# Altium schematic sheet FPGA_PortSwitcher(Nanoboard).SchDoc
size B; Organization: Altium Limited; Address1: L3, 12a Rodborough Rd; Address2: Frenchs Forest; Address3: NSW; Address4: Australia 2086
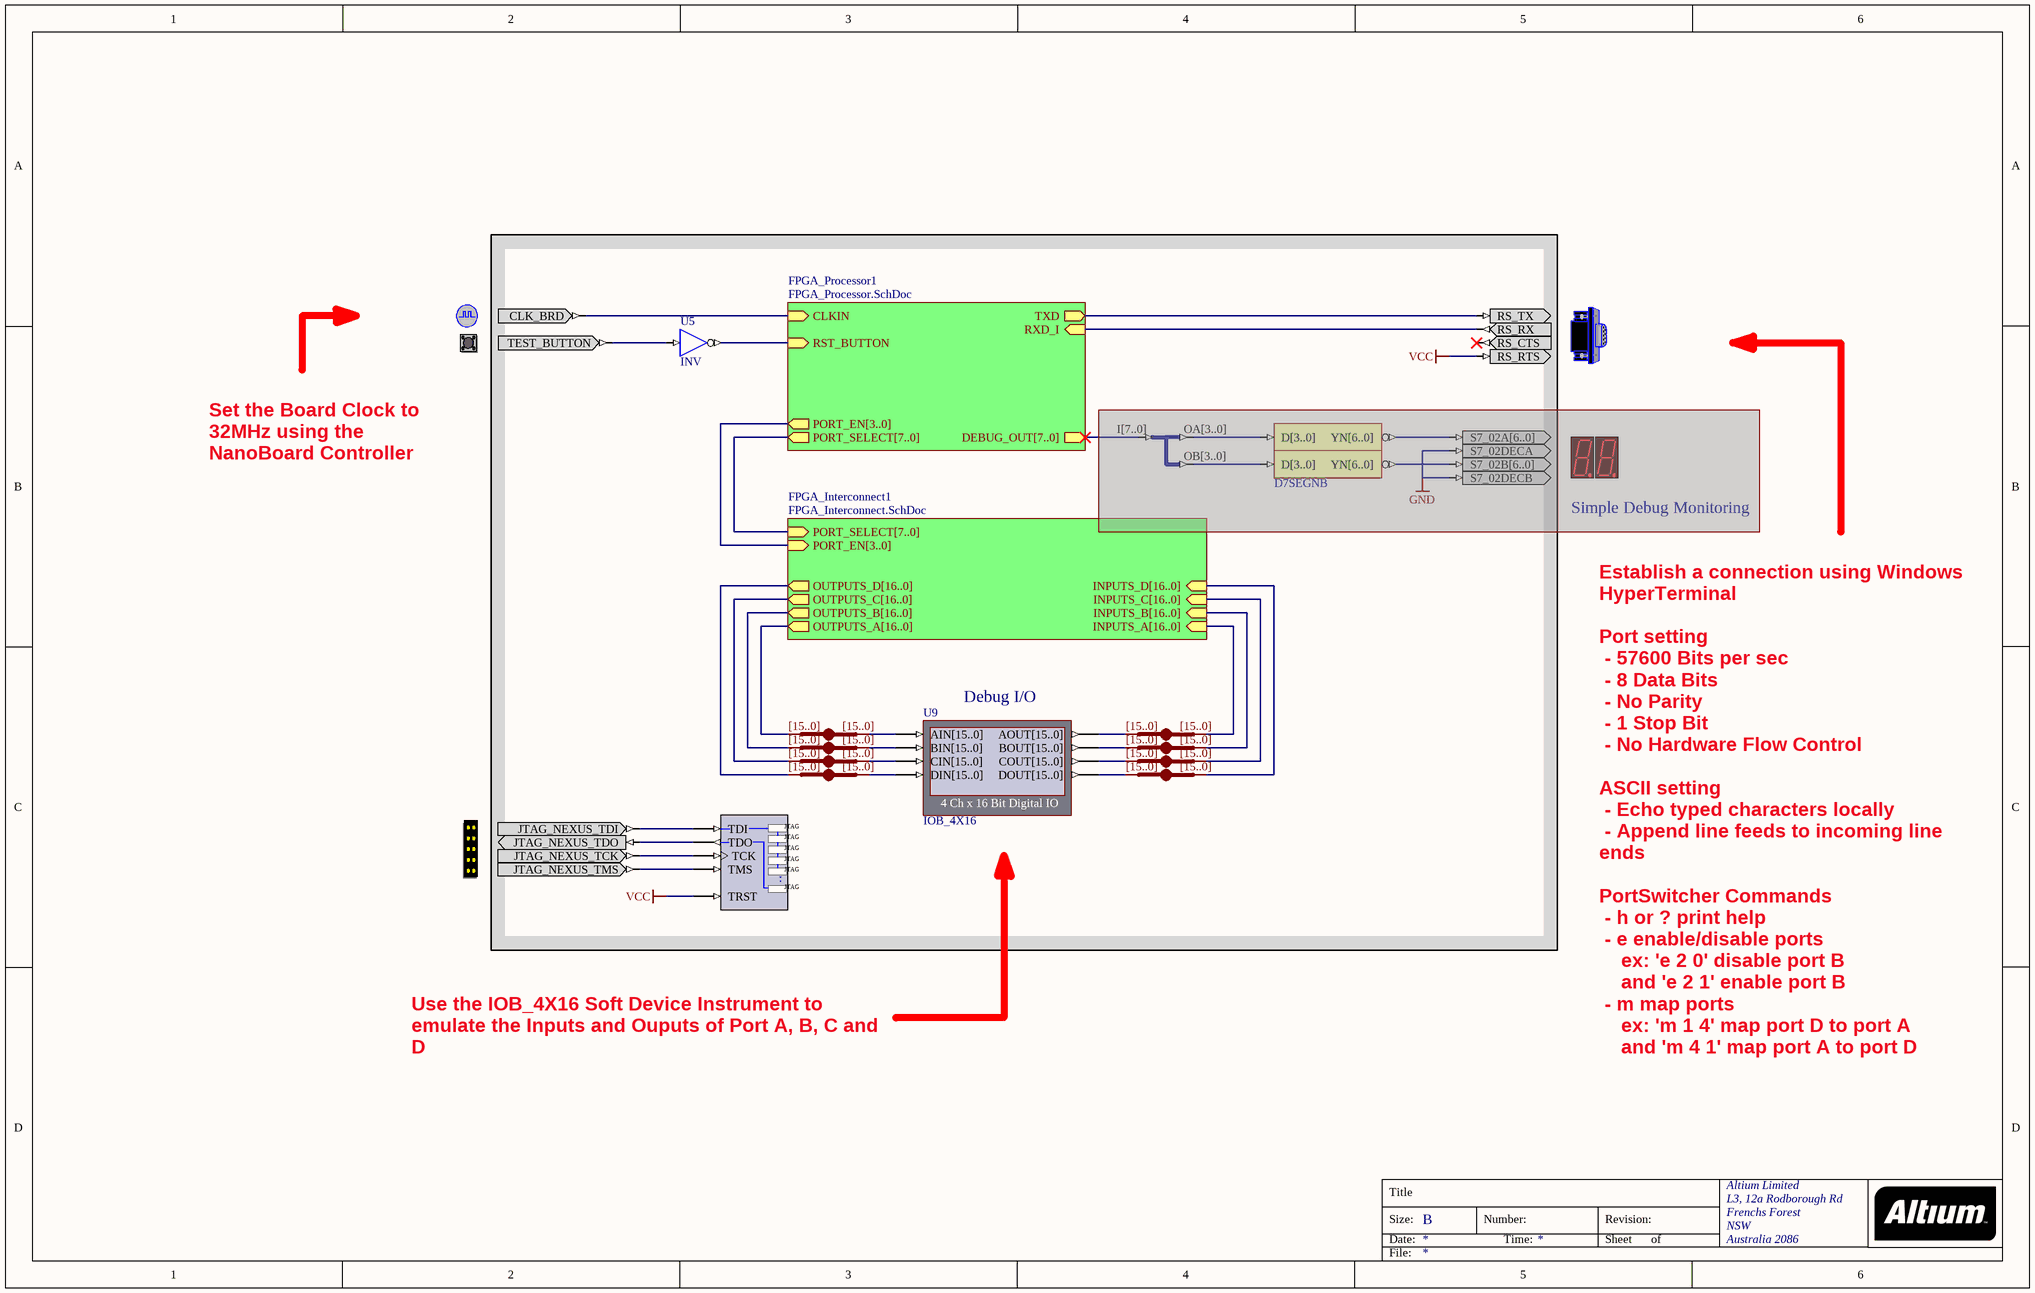
[diagram p0: FPGA_PortSwitcher(Nanoboard).SchDoc]

## Parts
(Parts that share a designator on the sheet are numbered #1, #2 ... from top to bottom, then left to right.)
?#1  CLOCK_BOARD  (value not drawn)
?#2  RS232CNTR  (value not drawn)
?#3  TEST_BUTTON  (value not drawn)
?#4  DUAL7SEGLEDUSERIO2  (value not drawn)  (masked out: inside a compile mask, not in the netlist)
?#5  NEXUS_JTAG_CONNECTOR  (value not drawn)
JB_S2  IndexA: [15..0]  (hidden comment: JB)
JB_S3  IndexA: [15..0]  (hidden comment: JB)
JB_S4  IndexA: [15..0]  (hidden comment: JB)
JB_S5  IndexA: [15..0]  (hidden comment: JB)
JB_S6  IndexA: [15..0]  (hidden comment: JB)
JB_S7  IndexA: [15..0]  (hidden comment: JB)
JB_S8  IndexA: [15..0]  (hidden comment: JB)
JB_S9  IndexA: [15..0]  (hidden comment: JB)
NEXUS_JTAG_PORT  NEXUS_JTAG_PORT  (value not drawn)
U5  INV
U6  D7SEGNB  (value not drawn)  (masked out: inside a compile mask, not in the netlist)
U7  D7SEGNB  (masked out: inside a compile mask, not in the netlist)
U8  J8B_4B2  (value not drawn)  (masked out: inside a compile mask, not in the netlist)
U9  IOB_4X16

## Blocks framed on the sheet
Debug I/O: ?#1-?#5 JB_S2-JB_S9 NEXUS_JTAG_PORT U5-U9

## Sub-sheets
FPGA_Interconnect1 = FPGA_Interconnect.SchDoc: PORT_SELECT[7..0] (in), OUTPUTS_D[16..0] (out), OUTPUTS_C[16..0] (out), OUTPUTS_B[16..0] (out), OUTPUTS_A[16..0] (out), PORT_EN[3..0] (in), INPUTS_A[16..0] (in), INPUTS_B[16..0] (in), INPUTS_C[16..0] (in), INPUTS_D[16..0] (in)
FPGA_Processor1 = FPGA_Processor.SchDoc: TXD (out), RXD_I (in), CLKIN (in), RST_BUTTON (in), PORT_SELECT[7..0] (out), PORT_EN[3..0] (out), DEBUG_OUT[7..0] (out)

## Nets
VCC: ?#2.RS_RTS NEXUS_JTAG_PORT.TRST
Net?#1_CLK_BRD: ?#1.CLK_BRD ; sheet FPGA_Processor1/CLKIN
Net?#2_RS_RX: ?#2.RS_RX ; sheet FPGA_Processor1/RXD_I
Net?#2_RS_TX: ?#2.RS_TX ; sheet FPGA_Processor1/TXD
Net?#3_TEST_BUTTON: ?#3.TEST_BUTTON U5.I
Net?#5_JTAG_NEXUS_TCK: ?#5.JTAG_NEXUS_TCK NEXUS_JTAG_PORT.TCK
Net?#5_JTAG_NEXUS_TDI: ?#5.JTAG_NEXUS_TDI NEXUS_JTAG_PORT.TDI
Net?#5_JTAG_NEXUS_TDO: ?#5.JTAG_NEXUS_TDO NEXUS_JTAG_PORT.TDO
Net?#5_JTAG_NEXUS_TMS: ?#5.JTAG_NEXUS_TMS NEXUS_JTAG_PORT.TMS
NetJB_S2_A[0..0]: JB_S2.A[0..0] ; sheet FPGA_Interconnect1/OUTPUTS_A[16..0]
NetJB_S2_B[0..0]: JB_S2.B[0..0] U9.AIN[15..0]
NetJB_S3_A[0..0]: JB_S3.A[0..0] U9.AOUT[15..0]
NetJB_S3_B[0..0]: JB_S3.B[0..0] ; sheet FPGA_Interconnect1/INPUTS_A[16..0]
NetJB_S4_A[0..0]: JB_S4.A[0..0] ; sheet FPGA_Interconnect1/OUTPUTS_B[16..0]
NetJB_S4_B[0..0]: JB_S4.B[0..0] U9.BIN[15..0]
NetJB_S5_A[0..0]: JB_S5.A[0..0] U9.BOUT[15..0]
NetJB_S5_B[0..0]: JB_S5.B[0..0] ; sheet FPGA_Interconnect1/INPUTS_B[16..0]
NetJB_S6_A[0..0]: JB_S6.A[0..0] ; sheet FPGA_Interconnect1/OUTPUTS_C[16..0]
NetJB_S6_B[0..0]: JB_S6.B[0..0] U9.CIN[15..0]
NetJB_S7_A[0..0]: JB_S7.A[0..0] U9.COUT[15..0]
NetJB_S7_B[0..0]: JB_S7.B[0..0] ; sheet FPGA_Interconnect1/INPUTS_C[16..0]
NetJB_S8_A[0..0]: JB_S8.A[0..0] ; sheet FPGA_Interconnect1/OUTPUTS_D[16..0]
NetJB_S8_B[0..0]: JB_S8.B[0..0] U9.DIN[15..0]
NetJB_S9_A[0..0]: JB_S9.A[0..0] U9.DOUT[15..0]
NetJB_S9_B[0..0]: JB_S9.B[0..0] ; sheet FPGA_Interconnect1/INPUTS_D[16..0]
NetU5_O: U5.O ; sheet FPGA_Processor1/RST_BUTTON

Not connected (* = marked no-connect by the designer): ?#2 RS_CTS*

## Buses and harness runs
bus sheet FPGA_Interconnect1/PORT_EN[3..0] = sheet FPGA_Processor1/PORT_EN[3..0]
bus sheet FPGA_Interconnect1/PORT_SELECT[7..0] = sheet FPGA_Processor1/PORT_SELECT[7..0]

## Notes on the sheet
- Set the Board Clock to 32MHz using the NanoBoard Controller
- Simple Debug Monitoring
- Use the IOB_4X16 Soft Device Instrument to emulate the Inputs and Ouputs of Port A, B, C and D
- Establish a connection using Windows HyperTerminal
  Port setting
  - 57600 Bits per sec
  - 8 Data Bits
  - No Parity
  - 1 Stop Bit
  - No Hardware Flow Control
  ASCII setting
  - Echo typed characters locally
  - Append line feeds to incoming line ends
  PortSwitcher Commands
  - h or ? print help
  - e enable/disable ports
  ex: 'e 2 0' disable port B
  and 'e 2 1' enable port B
  - m map ports
  ex: 'm 1 4' map port D to port A
  and 'm 4 1' map port A to port D
- Title
- Size:
- Date:
- B
- Number:
- Time:
- Revision:
- Sheet
- of
- File:
- (in symbol NEXUS_JTAG_PORT) JTAG; .

## Library data of the parts
?#1 = CLOCK_BOARD: Global System Clock Supply; PortComponent: True; Published: 19-Nov-2003; Publisher: Altium Limited
?#2 = RS232CNTR: DCE Serial Port Connector; PortComponent: True; Published: 19-Nov-2003; Publisher: Altium Limited
?#3 = TEST_BUTTON: Test Button; PortComponent: True; Published: 19-Nov-2003; Publisher: Altium Limited
?#4 = DUAL7SEGLEDUSERIO2: Dual 7-Segment LED; PortComponent: True; Published: 19-Nov-2003; Publisher: Altium Limited
?#5 = NEXUS_JTAG_CONNECTOR: JTAG Port; PortComponent: True; Published: 19-Nov-2003; Publisher: Altium Limited
JB_S2-JB_S9 = JB: System BUS Joiner; ArchiveName: GENERIC; Published: 18-Dec-2003; Publisher: Altium Limited; Core Revision: 1.00.00; IndexB: [15..0]
NEXUS_JTAG_PORT = NEXUS_JTAG_PORT: Soft Nexus-Chain Connector; NEXUS_JTAG_CONNECTOR: True; Published: 18-Dec-2003; Publisher: Altium Limited
U5 = INV: Inverter; ArchiveName: GENERIC; Published: 18-Dec-2003; Publisher: Altium Limited; Xilinx Equivalent: INV; Core Revision: 1.00.00
U6 U7 = D7SEGNB: 7-Segment-Display Decoder for Common-Anode LED (Active Low Output), Bus Version; ArchiveName: GENERIC; Published: 18-Dec-2003; Publisher: Altium Limited; Core Revision: 1.00.00
U8 = J8B_4B2: 1 x 8-bit input bus to 2 x 4-Bit output bus; ArchiveName: GENERIC; Published: 18-Dec-2003; Publisher: Altium Limited; Core Revision: 1.00.00
U9 = IOB_4X16: 4 Ch x 16 Bit Digital IO; NEXUS_CORE: Instrument; NEXUS_JTAG_DEVICE: True; NEXUS_JTAG_ORDER: 0; Published: 30/09/2003; Publisher: Altium Hobart Technology Centre; Core Revision: 1.00.00